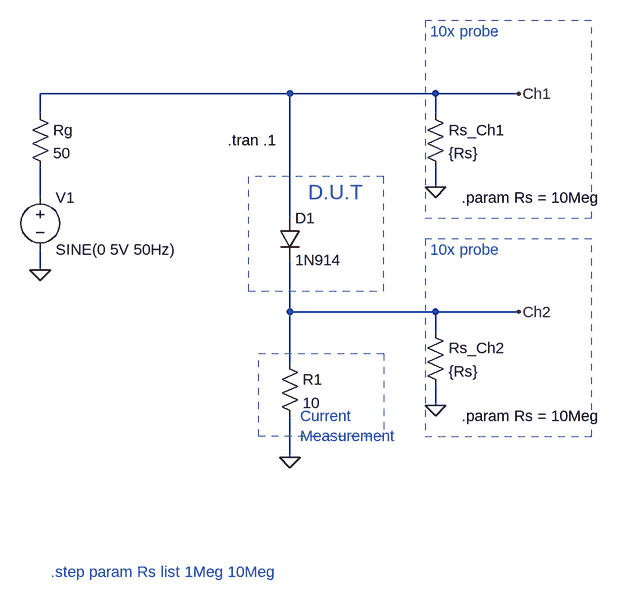
[diagram p0: schematic DUT_SETUP.asc]
DUT_SETUP.asc, the LTspice schematic file:
Version 4
SHEET 1 964 680
WIRE 336 -256 -48 -256
WIRE 560 -256 336 -256
WIRE 688 -256 560 -256
WIRE -48 -224 -48 -256
WIRE 560 -224 560 -256
WIRE 560 -112 560 -144
WIRE -48 -96 -48 -144
WIRE 336 -64 336 -256
WIRE -48 16 -48 -16
WIRE 336 80 336 0
WIRE 560 80 336 80
WIRE 688 80 560 80
WIRE 560 112 560 80
WIRE 336 160 336 80
WIRE 560 224 560 192
WIRE 336 304 336 240
FLAG 336 304 0
FLAG -48 16 0
FLAG 688 -256 Ch1
FLAG 560 -112 0
FLAG 688 80 Ch2
FLAG 560 224 0
SYMBOL voltage -48 -112 R0
WINDOW 123 0 0 Left 0
WINDOW 39 24 116 Left 2
SYMATTR InstName V1
SYMATTR Value SINE(0 5V 50Hz)
SYMBOL diode 320 -64 R0
SYMATTR InstName D1
SYMATTR Value 1N914
SYMBOL res 320 144 R0
SYMATTR InstName R1
SYMATTR Value 10
SYMATTR SpiceLine pwr=2
SYMBOL res -64 -240 R0
SYMATTR InstName Rg
SYMATTR Value 50
SYMBOL res 544 -240 R0
SYMATTR InstName Rs_Ch1
SYMATTR Value {Rs}
SYMBOL res 544 96 R0
SYMATTR InstName Rs_Ch2
SYMATTR Value {Rs}
TEXT 448 -104 Right 3 ;D.U.T
TEXT 352 240 Left 2 ;Current\nMeasurement
TEXT 240 -184 Left 2 !.tran .1
TEXT -32 480 Left 2 ;.step param Rs list 1Meg 10Meg
TEXT 600 -96 Left 2 !.param Rs = 10Meg
TEXT 552 -352 Left 2 ;10x probe
TEXT 600 240 Left 2 !.param Rs = 10Meg
TEXT 552 -16 Left 2 ;10x probe
RECTANGLE Normal 272 48 480 -128 2
RECTANGLE Normal 480 272 288 144 2
RECTANGLE Normal 544 -64 800 -368 2
RECTANGLE Normal 544 272 800 -32 2

The netlist it stands for:
* DUT_SETUP.asc
V1 N001 0 SINE(0 5V 50Hz)
D1 Ch1 Ch2 1N914
R1 Ch2 0 10 pwr=2
Rg Ch1 N001 50
Rs_Ch1 Ch1 0 {Rs}
Rs_Ch2 Ch2 0 {Rs}
.model D D
.lib standard.dio
* D.U.T
* Current
* Measurement
.tran .1
* .step param Rs list 1Meg 10Meg
.param Rs = 10Meg
* 10x probe
.param Rs = 10Meg
* 10x probe
.backanno
.end